# Altium project AdaptiveLightingHub.PrjPcb
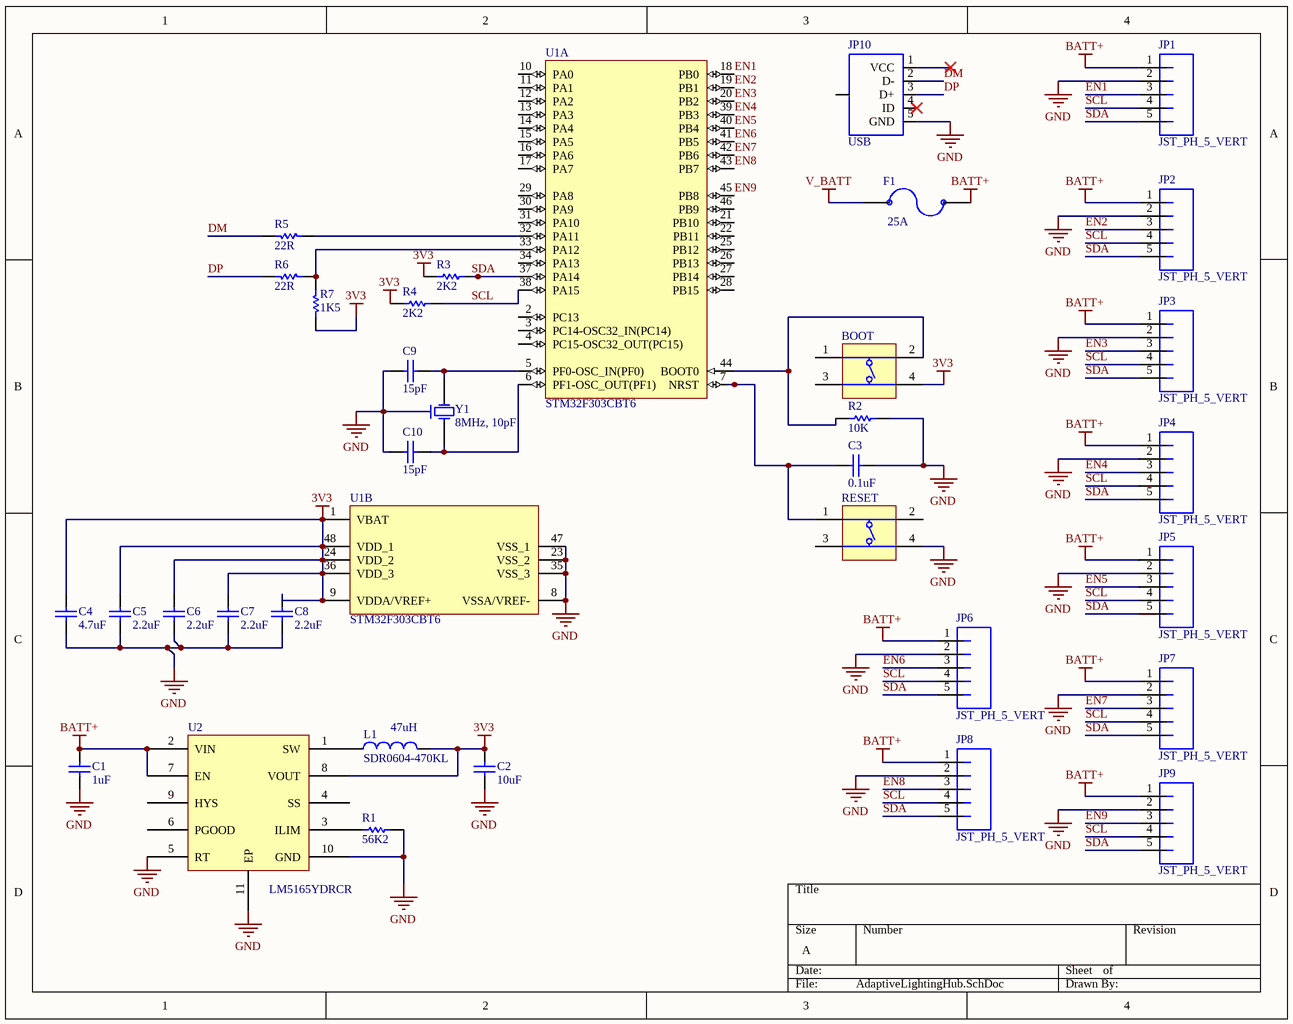
[diagram p0: AdaptiveLightingHub.SchDoc]
1 sheet, 34 parts. Net scope: global (net labels, ports and power ports of the same name join across sheets).
Board file: AdaptiveLightingHub.PcbDoc

## Sheet AdaptiveLightingHub.SchDoc
size A

### Parts
BOOT  (no value)  [SWITCH]
C1  1uF  [C0805[2012X120]]
C2  value 10uF  [C0402[1005X55]]  (hidden comment: 10uF 6.3V 0402)
C3  value 0.1uF  [C0402[1005X55]]  (hidden comment: 0.1uF 6.3V 0402)
C4  value 4.7uF  [C0402[1005X55]]  (hidden comment: 4.7uF 6.3V 0402)
C5  value 2.2uF  [C0402[1005X55]]  (hidden comment: 2.2uF 6.3V 0402)
C6  value 2.2uF  [C0402[1005X55]]  (hidden comment: 2.2uF 6.3V 0402)
C7  value 2.2uF  [C0402[1005X55]]  (hidden comment: 2.2uF 6.3V 0402)
C8  value 2.2uF  [C0402[1005X55]]  (hidden comment: 2.2uF 6.3V 0402)
C9  value 15pF  [C0402[1005X55]]  (hidden comment: 15pF 50V 0402)
C10  value 15pF  [C0402[1005X55]]  (hidden comment: 15pF 50V 0402)
F1  Current: 25A  [1206_FUSE]  (hidden comment: FUSE 1206)
JP1  JST_PH_5_VERT  [JST-PH-5-PTH-VERT]
JP2  JST_PH_5_VERT  [JST-PH-5-PTH-VERT]
JP3  JST_PH_5_VERT  [JST-PH-5-PTH-VERT]
JP4  JST_PH_5_VERT  [JST-PH-5-PTH-VERT]
JP5  JST_PH_5_VERT  [JST-PH-5-PTH-VERT]
JP6  JST_PH_5_VERT  [JST-PH-5-PTH-VERT]
JP7  JST_PH_5_VERT  [JST-PH-5-PTH-VERT]
JP8  JST_PH_5_VERT  [JST-PH-5-PTH-VERT]
JP9  JST_PH_5_VERT  [JST-PH-5-PTH-VERT]
JP10  USB  [USB-MICROB]
L1  SDR0604-470KL  value 47uH  [SDR0604]
R1  value 56K2  [R0402[1005]]  (hidden comment: 56K2 1% 0402)
R2  value 10K  [R0402[1005]]  (hidden comment: 10K 1% 0402)
R3  value 2K2  [R0402[1005]]  (hidden comment: 2K2 1% 0402)
R4  value 2K2  [R0402[1005]]  (hidden comment: 2K2 1% 0402)
R5  value 22R  [R0402[1005]]  (hidden comment: 22R 1% 0402)
R6  value 22R  [R0402[1005]]  (hidden comment: 22R 1% 0402)
R7  value 1K5  [R0402[1005]]  (hidden comment: 1K5 1% 0402)
RESET  (no value)  [SWITCH]
U1  STM32F303CBT6  [LQFP-48]  (parts A,B of 2)
U2  LM5165YDRCR  [VSON-10 (3mmx3mm)]
Y1  8MHz, 10pF  [ABRA-ABM3B-4_V]

### Nets
3V3: BOOT.4(T3) C2.2 C4.2 C5.2 C6.2 C7.2 C8.2 L1.2 R3.1 R4.1 R7.1 U1.1(VBAT) U1.9(VDDA/VREF+) U1.24(VDD_2) U1.36(VDD_3) U1.48(VDD_1) U2.8(VOUT)
BATT+: C1.2 F1.2 JP1.1 JP2.1 JP3.1 JP4.1 JP5.1 JP6.1 JP7.1 JP8.1 JP9.1 U2.2(VIN) U2.7(EN)
GND: C1.1 C2.1 C3.2 C4.1 C5.1 C6.1 C7.1 C8.1 C9.1 C10.1 JP1.2 JP2.2 JP3.2 JP4.2 JP5.2 JP6.2 JP7.2 JP8.2 JP9.2 JP10.5(GND) R1.2 R2.2 RESET.4(T3) U1.8(VSSA/VREF-) U1.23(VSS_2) U1.35(VSS_3) U1.47(VSS_1) U2.5(RT) U2.10(GND) U2.11(EP) Y1.2
V_BATT: F1.1
DM: JP10.2(D-) R5.2
DP: JP10.3(D+) R6.2
EN1: JP1.3 U1.18(PB0)
EN2: JP2.3 U1.19(PB1)
EN3: JP3.3 U1.20(PB2)
EN4: JP4.3 U1.39(PB3)
EN5: JP5.3 U1.40(PB4)
EN6: JP6.3 U1.41(PB5)
EN7: JP7.3 U1.42(PB6)
EN8: JP8.3 U1.43(PB7)
EN9: JP9.3 U1.45(PB8)
SCL: JP1.4 JP2.4 JP3.4 JP4.4 JP5.4 JP6.4 JP7.4 JP8.4 JP9.4 R4.2 U1.38(PA15)
SDA: JP1.5 JP2.5 JP3.5 JP4.5 JP5.5 JP6.5 JP7.5 JP8.5 JP9.5 R3.2 U1.37(PA14)
NetBOOT_2: BOOT.2(T2) R2.1 U1.44(BOOT0)
NetC3_1: C3.1 RESET.1(T1) U1.7(NRST)
NetC9_2: C9.2 U1.5(PF0-OSC_IN(PF0)) Y1.1(X1)
NetC10_2: C10.2 U1.6(PF1-OSC_OUT(PF1)) Y1.3(X2)
NetL1_1: L1.1 U2.1(SW)
NetR1_1: R1.1 U2.3(ILIM)
NetR5_1: R5.1 U1.32(PA11)
NetR6_1: R6.1 R7.2 U1.33(PA12)

Not connected (* = marked no-connect by the designer): BOOT 1(T1) 3(T3); JP10 1(VCC)* 4(ID)* 6(SHIELD); RESET 2(T2) 3(T3); U1 2(PC13) 3(PC14-OSC32_IN(PC14)) 4(PC15-OSC32_OUT(PC15)) 10(PA0) 11(PA1) 12(PA2) 13(PA3) 14(PA4) 15(PA5) 16(PA6) 17(PA7) 21(PB10) 22(PB11) 25(PB12) 26(PB13) 27(PB14) 28(PB15) 29(PA8) 30(PA9) 31(PA10) 34(PA13) 46(PB9); U2 4(SS) 6(PGOOD) 9(HYS)

### Library data of the parts
BOOT RESET = DIPT-DTSM-6: Switch, SPNO Push Button SMD; Manufacturer: C&K Components; PartNumber: PTS810 SJM 250 SMTR LFS; Packing Type: Tape&Reel; Mechanical Life: 200,000 cycles; ComponentLink2URL: http://www.dip.com.tw/Products_tact.htm; ComponentLink1URL: http://www.dip.com.tw/; ComponentLink3URL: http://www.dip.com.tw/PDF/pro_tact/DTSM_G_-6_2_-V.pdf; PackageDescription: Switch, Surface Mount, 4 Leads, Body 4.6x2.8mm, Height 1.9mm; ComponentLink2Description: Datasheet; ComponentLink3Description: Package Specification; ComponentLink1Description: Manufacturer URL; PackageReference: PTS810; Mounting Technology: Surface Mount
C1 = CAP_1uF_100V_0805_20%: CAP_1uF 100V 20% 0805 (2012 metric); Manufacturer: TDK; PartNumber: C2012X7S2A474M125AE; Mounting Technology: Surface Mount; Voltage: 100V; Package Description: 0805 (2012 Metric); Package Reference: 0805; Tolerance: 20%; Value: 1uF
C2 = CAP_10uF_6.3V_0402_20%: 10uF 6.3V 20% 0402 (1005 Metric); PartNumber: GRM155R60J106ME44D; Manufacturer: Murata; Mounting Technology: Surface Mount; PackageReference: 0402; PackageDescription: 0402 (1005 Metric); Voltage: 6.3V; Tolerance: 20%
C3 = CAP_0.1uF_6.3V_0402_10%: 0.1uF 6.3V 10% 0402 (1005 Metric); PartNumber: GRM155R70J104KA01D; Manufacturer: Murata; Tolerance: 10%; Mounting Technology: Surface Mount; PackageReference: 0402; PackageDescription: 0402 (1005 Metric); Voltage: 6.3V
C4 = CAP_4.7uF_6.3V_0402_20%: 4.7uF 6.3V 20% 0402 (1005 Metric); PartNumber: GRM155R60J475ME47D; Manufacturer: Murata; Tolerance: 20%; Mounting Technology: Surface Mount; PackageReference: 0402; PackageDescription: 0402 (1005 Metric); Voltage: 6.3V
C5-C8 = CAP_2.2uF_6.3V_0402_20%: 2.2uF 6.3V 20% 0402 (1005 Metric); PartNumber: GRM155R60J225ME15D; Manufacturer: Murata; Tolerance: 20%; Mounting Technology: Surface Mount; PackageReference: 0402; PackageDescription: 0402 (1005 Metric); Voltage: 6.3V
C9 C10 = CAP_15pF_50V_0402_5%: 15pF 50V 5% 0402 (1005 Metric); PartNumber: GRM1555C1H150JA01D; Manufacturer: Murata; Tolerance: 5%; Mounting Technology: Surface Mount; PackageReference: 0402; PackageDescription: 0402 (1005 Metric); Voltage: 50V
F1 = FUSE 1206: Surface Mount Fuses UST 1206 FUSE 25A F; PartNumber: 3413.0332.22; Manufacturer: Schurter; Mounting Technology: Surface Mount; PackageReference: 1206; PackageDescription: 1206 (3216 Metric)
JP1-JP9 = JST_PH_5_VERT: Manufacturer: JST Sales America, Inc.; PartNumber: B5B-PH-K-S(LF)(SN); PackageReference: JST-PH; Mounting Technology: Through Hole
JP10 = USB_MICROB_SMT: pin to pad: 1>VBUS 2>D- 3>D+ 4>ID 5>GND 6>MT1+P$1+P$2+MT2; PartNumber: 10118192-0001LF; Manufacturer: Amphenol FCI; Mounting Technology: Surface Mount; PackageReference: USB - Micro B
L1 = SDR0604-470KL: 47uH 10% 0.72A 0604; Manufacturer: Bourns; PartNumber: SDR0604-470KL; PackageReference: SDR0604; Mounting Technology: Surface Mount; Current: 0.72A
R1 = RES_56K2_0402_1%: 56K2 0.063W 1% 0402 (1005 Metric); Manufacturer: KOA Speer; PartNumber: RK73H1ETTP5622F; Tolerance: 1%; Power: 0.063W; Mounting Technology: Surface Mount; PackageReference: 0402; PackageDescription: 0402 (1005 Metric); ComponentLink1Description: Datasheet; ComponentLink1URL: http://www.koaspeer.com/catimages/Products/RK73H/RK73H.pdf
R2 = RES_10K_0402_1%: 10K 0.063W 1% 0402 (1005 Metric); Manufacturer: KOA Speer; PartNumber: RK73H1ETTP1002F; Tolerance: 1%; Power: 0.063W; Mounting Technology: Surface Mount; PackageReference: 0402; PackageDescription: 0402 (1005 Metric); ComponentLink1Description: Datasheet; ComponentLink1URL: http://www.koaspeer.com/catimages/Products/RK73H/RK73H.pdf
R3 R4 = RES_2K2_0402_1%: 2K2 0.063W 1% 0402 (1005 Metric); Manufacturer: KOA Speer; PartNumber: RK73H1ETTP2201F; Tolerance: 1%; Power: 0.063W; Mounting Technology: Surface Mount; PackageReference: 0402; PackageDescription: 0402 (1005 Metric); ComponentLink1Description: Datasheet; ComponentLink1URL: http://www.koaspeer.com/catimages/Products/RK73H/RK73H.pdf
R5 R6 = RES_22R_0402_1%: 22R 0.063W 1% 0402 (1005 Metric); Manufacturer: KOA Speer; PartNumber: RK73H1ETTP22R0F; Power: 0.063W; Tolerance: 1%; Mounting Technology: Surface Mount; PackageReference: 0402; PackageDescription: 0402 (1005 Metric); ComponentLink1Description: Datasheet; ComponentLink1URL: http://www.koaspeer.com/catimages/Products/RK73H/RK73H.pdf
R7 = RES_1K5_0402_1%: 1K5 0.063W 1% 0402 (1005 Metric); Manufacturer: KOA Speer; PartNumber: RK73H1ETTP1501F; Tolerance: 1%; Power: 0.063W; Mounting Technology: Surface Mount; PackageReference: 0402; PackageDescription: 0402 (1005 Metric); ComponentLink1Description: Datasheet; ComponentLink1URL: http://www.koaspeer.com/catimages/Products/RK73H/RK73H.pdf
U1 = STM32F303CBT6: Manufacturer: STMicroelectronics; PartNumber: STM32F303CBT6; Mounting Technology: Surface Mount; PackageReference: LQFP-48; PackageDescription: QFP, 48-Leads, Body 7x7mm, Pitch 0.5mm
U2 = LM5165YDRCR: LM5165 3-V to 65-V Input, 150-mA Synchronous Buck Converter; Manufacturer: Texas Instruments; PartNumber: LM5165YDRCR; Mounting Technology: Surface Mount; PackageReference: VSON-10
Y1 = ABRA-ABM3B-4: PartNumber: ABM3B-8.000MHZ-10-1UT; Manufacturer: ABRACON; Mounting Technology: Surface Mount; PackageReference: 2012; PackageDescription: 2012 (5032 metric)